# EAGLE design danger (EAGLE 6.6.0)
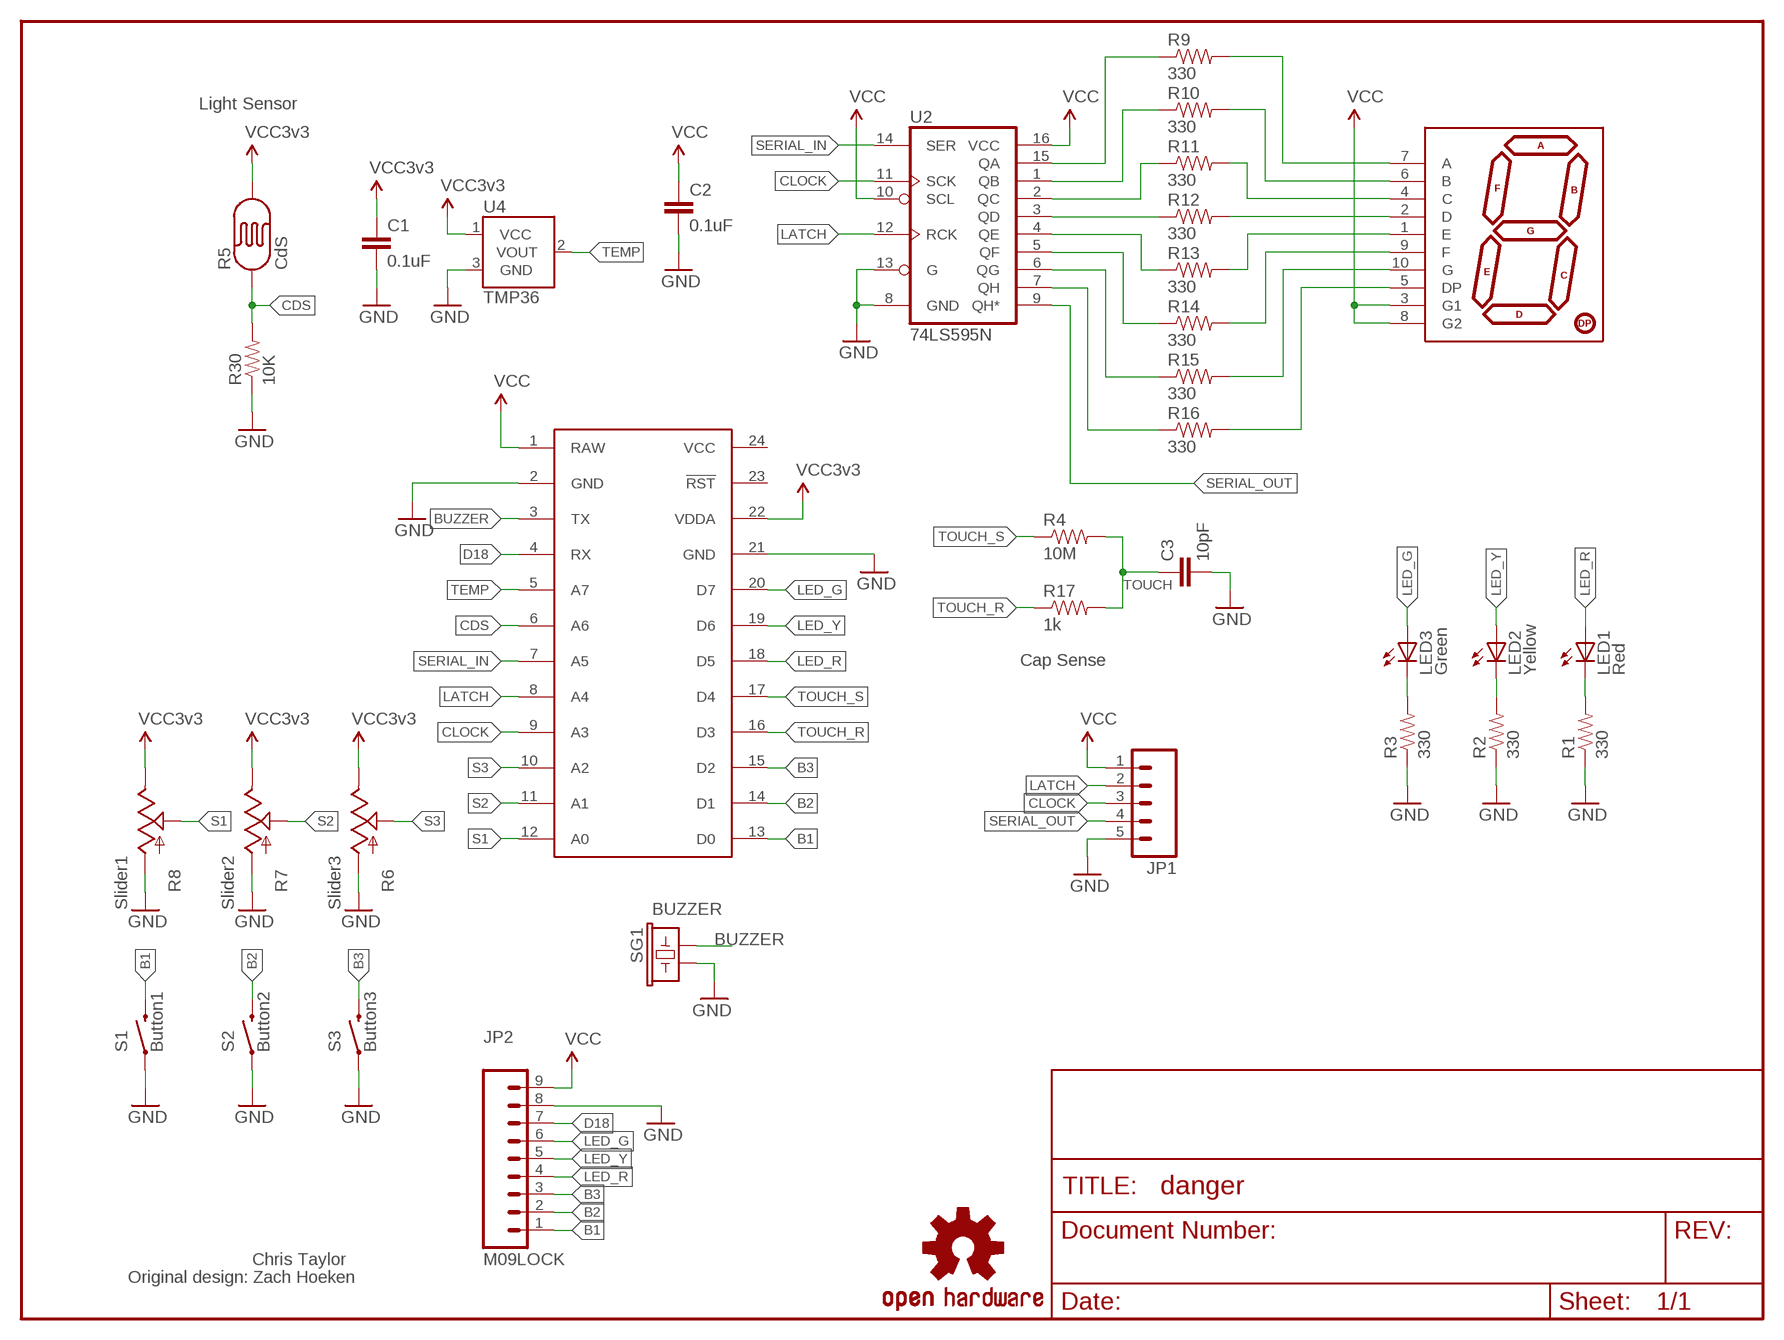
[diagram p0: schematic, sheet 1]

## Parts
C1  0.1uF  CAPPTH2  [CAP-PTH-SMALL2]
C2  0.1uF  CAPPTH2  [CAP-PTH-SMALL2]
C3  10pF  CAPPTH2  [CAP-PTH-SMALL2]
IC1  SPARK_CORECORE  [SPARK_CORE]
JP1  M05PTH  [1X05]
JP2  M09LOCK  [1X09_LOCK]
LED1  Red  LED5MM  [LED5MM]
LED2  Yellow  LED5MM  [LED5MM]
LED3  Green  LED5MM  [LED5MM]
R1  330  RESISTORAXIAL-0.3  [AXIAL-0.3]
R2  330  RESISTORAXIAL-0.3  [AXIAL-0.3]
R3  330  RESISTORAXIAL-0.3  [AXIAL-0.3]
R4  10M  RESISTORAXIAL-0.3  [AXIAL-0.3]
R5  CdS  PHOTOCELLPTH  [PHOTOCELL]
R6  Slider3  SLIDER  [SLIDER]
R7  Slider2  SLIDER  [SLIDER]
R8  Slider1  SLIDER  [SLIDER]
R9  330  RESISTORAXIAL-0.3  [AXIAL-0.3]
R10  330  RESISTORAXIAL-0.3  [AXIAL-0.3]
R11  330  RESISTORAXIAL-0.3  [AXIAL-0.3]
R12  330  RESISTORAXIAL-0.3  [AXIAL-0.3]
R13  330  RESISTORAXIAL-0.3  [AXIAL-0.3]
R14  330  RESISTORAXIAL-0.3  [AXIAL-0.3]
R15  330  RESISTORAXIAL-0.3  [AXIAL-0.3]
R16  330  RESISTORAXIAL-0.3  [AXIAL-0.3]
R17  1k  RESISTORAXIAL-0.3  [AXIAL-0.3]
R30  10K  RESISTORAXIAL-0.3  [AXIAL-0.3]
S1  Button1  SWITCH-MOMENTARY-212MM  [TACTILE-PTH-12MM]
S2  Button2  SWITCH-MOMENTARY-212MM  [TACTILE-PTH-12MM]
S3  Button3  SWITCH-MOMENTARY-212MM  [TACTILE-PTH-12MM]
SG1  BUZZER  BUZZERPTH  [BUZZER-12MM]
U2  74LS595N  [DIL16]
U4  TMP36  TMP36GT9  [TO-92]
U6  7-SEGMENT-DISPLAY-1"-RED  [7-SEGMENT-1"PTH]
U$2  OSHW-LOGOM  [OSHW-LOGO-M]

## Nets
B1: IC1.13(D0) JP2.1 S1.3
B2: IC1.14(D1) JP2.2 S2.3
B3: IC1.15(D2) JP2.3 S3.3
BUZZER: IC1.3(TX) SG1.+
CDS: IC1.6(A6) R5.1 R30.P$2
CLOCK: IC1.9(A3) JP1.3 U2.11(SCK)
D18: IC1.4(RX) JP2.7
GND: C1.2 C2.2 C3.2 IC1.2(GND) IC1.21(GND) JP1.5 JP2.8 R1.P$1 R2.P$1 R3.P$1 R6.3(A) R7.3(A) R8.3(A) R30.P$1 S1.1 S2.1 S3.1 SG1.- U2.8(GND) U2.13(G) U4.3(GND)
LATCH: IC1.8(A4) JP1.2 U2.12(RCK)
LED_G: IC1.20(D7) JP2.6 LED3.A
LED_R: IC1.18(D5) JP2.4 LED1.A
LED_Y: IC1.19(D6) JP2.5 LED2.A
N$2: R9.P$1 U2.15(QA)
N$3: LED1.K(C) R1.P$2
N$4: R10.P$1 U2.1(QB)
N$5: R11.P$1 U2.2(QC)
N$6: R12.P$1 U2.3(QD)
N$7: R13.P$1 U2.4(QE)
N$8: R14.P$1 U2.5(QF)
N$9: R15.P$1 U2.6(QG)
N$10: R16.P$1 U2.7(QH)
N$11: R9.P$2 U6.7(A)
N$12: R10.P$2 U6.6(B)
N$13: R11.P$2 U6.4(C)
N$14: R12.P$2 U6.2(D)
N$15: R13.P$2 U6.1(E)
N$16: R14.P$2 U6.9(F)
N$17: R15.P$2 U6.10(G)
N$18: R16.P$2 U6.5(DP)
N$19: LED2.K(C) R2.P$2
N$20: LED3.K(C) R3.P$2
S1: IC1.12(A0) R8.2A(S)
S2: IC1.11(A1) R7.2A(S)
S3: IC1.10(A2) R6.2A(S)
SERIAL_IN: IC1.7(A5) U2.14(SER)
SERIAL_OUT: JP1.4 U2.9(QH*)
TEMP: IC1.5(A7) U4.2(VOUT)
TOUCH: C3.1 R4.P$2 R17.P$2
TOUCH_R: IC1.16(D3) R17.P$1
TOUCH_S: IC1.17(D4) R4.P$1
VCC: C2.1 IC1.1(RAW) JP1.1 JP2.9 U2.10(SCL) U2.16(VCC) U6.3(G1) U6.8(G2)
VCC3V3: C1.1 IC1.22(VDDA) R5.2 R6.1(E) R7.1(E) R8.1(E) U4.1(VCC) ; supply symbol labelled VCC3v3
Unconnected: IC1.23(!RST)

## Notes on the sheet
- Light Sensor
- Cap Sense
- Chris Taylor
- Original design: Zach Hoeken

## Power pins joined to a net without a drawn wire
VCC: IC1.24(VCC)

## Library data of the parts
C1-C3 = SparkFun-Passives:CAP: Capacitor Standard 0603 ceramic capacitor, and 0.1" leaded capacitor.
IC1 = Spark:SPARK_CORE
JP1 = SparkFun:M05: Header 5 Standard 5-pin 0.1" header. Use with straight break away headers (SKU : PRT-00116), right angle break away headers (PRT-00553), swiss pins (PRT-00743), machine pins (PRT-00117), and female headers (PRT-00115). Molex polarized connector foot print use with SKU : PRT-08230 with associated crimp pins and housings.
JP2 = SparkFun-Connectors:M09: Header 9 Standard 9-pin 0.1" header. Use with straight break away headers (SKU : PRT-00116), right angle break away headers (PRT-00553), swiss pins (PRT-00743), machine pins (PRT-00117), and female headers (PRT-00115).
LED1-LED3 = SparkFun:LED: LEDs Standard schematic elements and footprints for 5mm, 3mm, 1206, and 0603 sized LEDs. 5mm - Spark Fun Electronics SKU : COM-00529 (and others)
R1-R4 R9-R17 R30 = SparkFun:RESISTOR: Resistor Basic schematic elements and footprints for 0603, 1206, and PTH resistors.
R5 = SparkFun:PHOTOCELL: Photocell Also known as a CdS photoresistor. This is a low cost way to detect light levels. Resistance decreases with more incoming light. SparkFun SKU: SEN-09088
R6-R8 = SparkFun:SLIDER
S1-S3 = SparkFun:SWITCH-MOMENTARY-2
SG1 = SparkFun:BUZZER: Buzzer 12mm Spark Fun Electronics SKU : Comp-Buzzer
U2 = SparkFun:74*595: 8-bit SHIFT REGISTER, output latch
U4 = SparkFun-Sensors:TMP36: Precision degC temp sensor, analog out
U6 = SparkFun:7-SEGMENT-DISPLAY-1"-RED: 7-Segment Display 1" Red (COM-08546)
U$2 = SparkFun-Aesthetics:OSHW-LOGO: Open Source Hardware Logo This logo indicates the piece of hardware it is found on incorporates a OSHW license and/or adheres to the definition of open source hardware found here: http://freedomdefined.org/OSHW

## Board
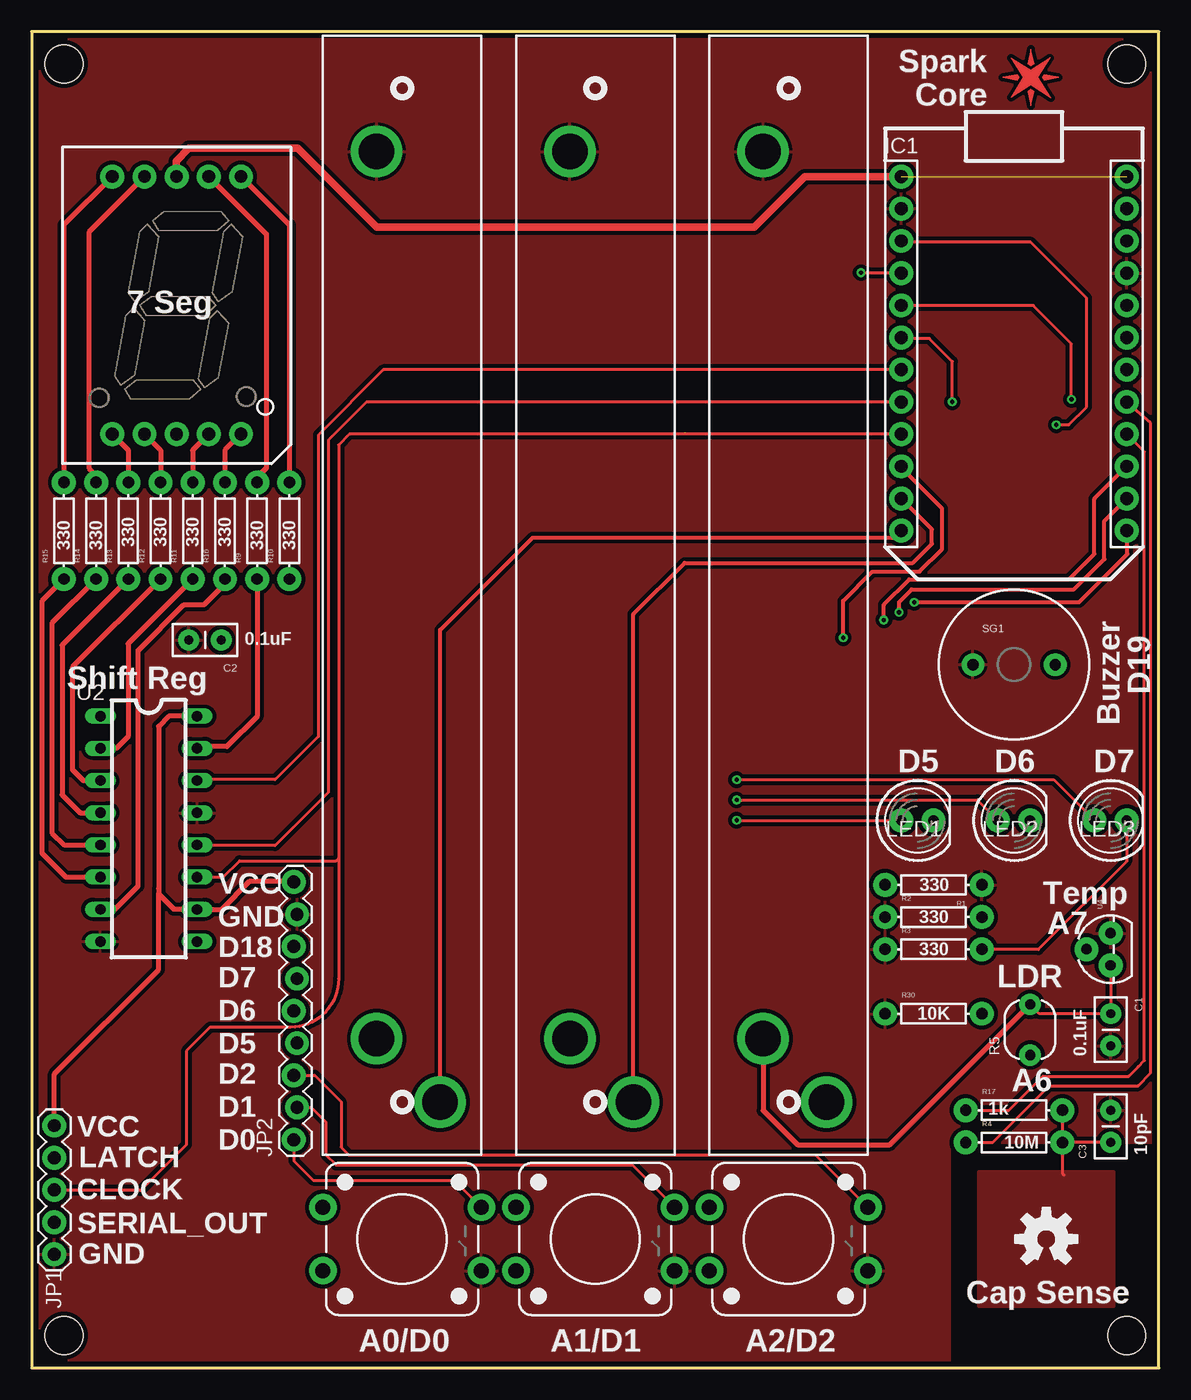
[diagram p1: board, top side]
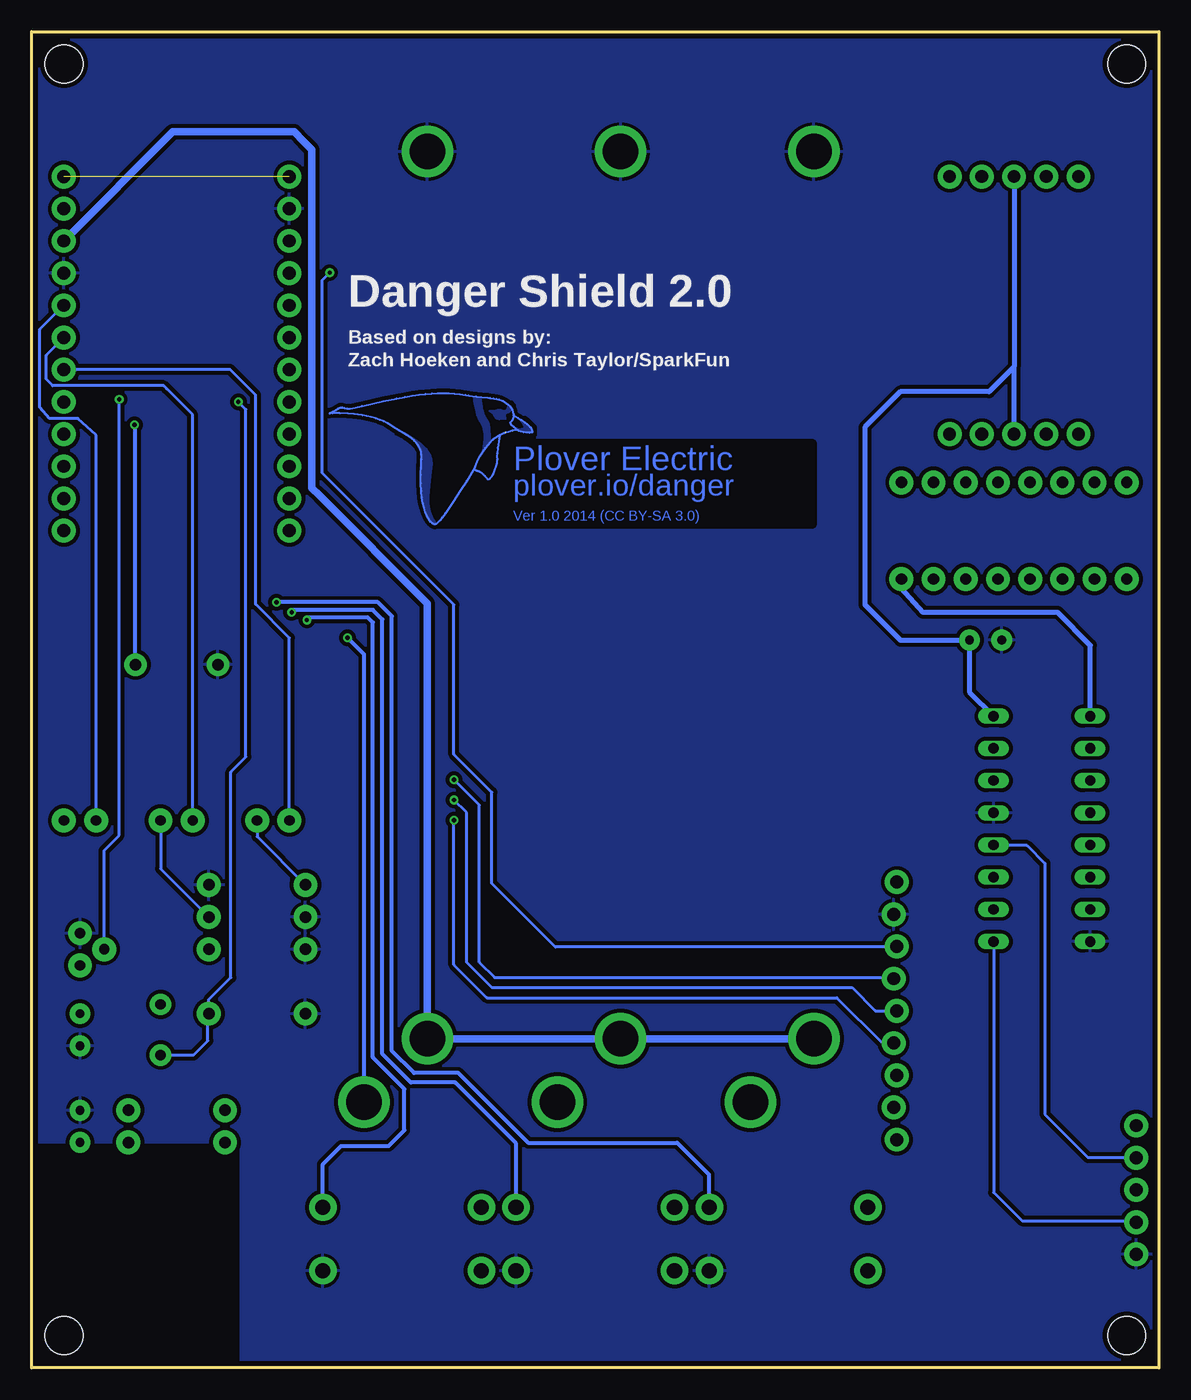
[diagram p2: board, bottom side, seen from below]

Size 88.9 x 105.41 mm. Coordinates in mm from the lower left corner, seen from the top.
Outline: 0,0 88.9,0 88.9,105.41 0,105.41 0,0
Copper layers (1*16): Top 0.0356mm / dielectric 1.5011mm / Bottom 0.0356mm
Design rules "LaenPCBOrder": minimum track width 6mil, minimum drill 13mil, track to track 6mil, track to pad 6mil, pad to pad 6mil, via to via 6mil, smd to smd 6mil, copper to edge 15mil, drill to drill 6mil, minimum pad ring 7mil, minimum via ring 7mil, stop-mask expansion 3mil, vias tented up to drill 0mil, thermal gap 10mil
Holes 3 mm at 2.54,102.87 86.36,102.87 2.54,2.54 86.36,2.54
bRestrict: area 27.3,66.6 to 56.6,72.9

### Footprints (pad centres in the part's own frame; a part is rotated, then mirrored left to right if it is on the bottom)
CAP-PTH-SMALL2 = drill 0.7 pad 1.651: 1 0,0; 2 2.54,0
SPARK_CORE = drill 1.016 pad 1.88: 1 -8.89,13.97; 2 -8.89,11.43; 3 -8.89,8.89; 4 -8.89,6.35; 5 -8.89,3.81; 6 -8.89,1.27; 7 -8.89,-1.27; 8 -8.89,-3.81; 9 -8.89,-6.35; 10 -8.89,-8.89; 11 -8.89,-11.43; 12 -8.89,-13.97; 13 8.89,-13.97; 14 8.89,-11.43; 15 8.89,-8.89; 16 8.89,-6.35; 17 8.89,-3.81; 18 8.89,-1.27; 19 8.89,1.27; 20 8.89,3.81; 21 8.89,6.35; 22 8.89,8.89; 23 8.89,11.43; 24 8.89,13.97
1X05 = drill 1.016 pad 1.88: 1 0,0; 2 2.54,0; 3 5.08,0; 4 7.62,0; 5 10.16,0
1X09_LOCK = drill 1.016 pad 1.88: 1 0,0.127; 2 2.54,-0.127; 3 5.08,0.127; 4 7.62,-0.127; 5 10.16,0.127; 6 12.7,-0.127; 7 15.24,0.127; 8 17.78,-0.127; 9 20.32,0.127
LED5MM = drill 0.813 pad 1.88: A -1.27,0; K 1.27,0
AXIAL-0.3 = drill 0.9 pad 1.88: P$1 -3.81,0; P$2 3.81,0
PHOTOCELL = drill 0.8 pad 1.676: 1 -2,0; 2 2,0
SLIDER = drill 2.8 pad 4.064: 1 -35,2; 2A -40,-3; 3 35,2
TACTILE-PTH-12MM = drill 1.2 pad 2.159: 1 6.25,-2.5; 2 -6.25,-2.5; 3 6.25,2.5; 4 -6.25,2.5
BUZZER-12MM = drill 0.9 pad 1.778: + 3.25,0; - -3.25,0
DIL16 = drill 0.813 long: 1 -8.89,-3.81; 2 -6.35,-3.81; 3 -3.81,-3.81; 4 -1.27,-3.81; 5 1.27,-3.81; 6 3.81,-3.81; 7 6.35,-3.81; 8 8.89,-3.81; 9 8.89,3.81; 10 6.35,3.81; 11 3.81,3.81; 12 1.27,3.81; 13 -1.27,3.81; 14 -3.81,3.81; 15 -6.35,3.81; 16 -8.89,3.81
TO-92 = drill 0.813 pad 1.88: 1 -1.27,0; 2 0,1.905; 3 1.27,0
7-SEGMENT-1"PTH = drill 1 pad 1.88: 1 -5.08,-10.16; 2 -2.54,-10.16; 3 0,-10.16; 4 2.54,-10.16; 5 5.08,-10.16; 6 5.08,10.16; 7 2.54,10.16; 8 0,10.16; 9 -2.54,10.16; 10 -5.08,10.16

### Placement (x,y rotation side)
C1  85.09,27.94 270 top
C2  14.94,57.42 180 top
C3  85.09,17.78 90 top
IC1  77.47,80.01 0 top
JP1  1.79,19.11 270 top
JP2  20.8,18 90 top
LED1  69.85,43.18 0 top
LED2  77.47,43.18 0 top
LED3  85.09,43.18 0 top
R1  71.12,38.1 180 top
R2  71.12,35.56 0 top
R3  71.12,33.02 0 top
R4  77.47,17.78 0 top
R5  78.74,26.67 90 top
R6  59.69,60.96 90 top
R7  44.45,60.96 90 top
R8  29.21,60.96 90 top
R9  17.78,66.04 90 top
R10  20.32,66.04 90 top
R11  12.7,66.04 90 top
R12  10.16,66.04 90 top
R13  7.62,66.04 90 top
R14  5.08,66.04 90 top
R15  2.54,66.04 90 top
R16  15.24,66.04 90 top
R17  77.47,20.32 0 top
R30  71.12,27.94 0 top
S1  29.21,10.16 0 top
S2  44.45,10.16 0 top
S3  59.69,10.16 0 top
SG1  77.47,55.48 0 top
U2  9.23,42.52 270 top
U4  85.09,33.02 90 top
U6  11.43,83.82 0 top
U$1  [SPARK_LOGO_PLUS_PLANE]  78.8,101.8 0 top
U$2  80.01,10.16 0 top

### Tracks (layer width: path | path; a pad name or v marks a point on that pad's centre or on a via)
B1  (via drill 0.33)
  Top 0.254: JP2.1 20.67,16.33 22.2,14.8 33.32,14.8 S1.3
  Top 0.305: v69.6,60.4 82.6,60.4 86.4,64.2 86.4,66 IC1.13
  Bottom 0.305: S1.3 35.5,12.7 35.5,15.25 38,17.75 49.75,17.75 55.25,23.25 58.75,23.25 60.5,25 60.5,59.3 61.6,60.4 v69.6,60.4
B2  (via drill 0.33)
  Top 0.254: JP2.2 22.06,20.54 23.2,19.4 23.2,16.8 24,16 47.36,16 S2.3
  Top 0.305: v68.4,59.6 68.4,60.4 69.4,61.4 82.2,61.4 84.6,63.8 84.6,66.82 IC1.14
  Bottom 0.305: S2.3 50.7,17.7 55.5,22.5 59,22.5 61.25,24.75 61.25,59.05 62,59.8 68.2,59.8 v68.4,59.6
B3  (via drill 0.33)
  Top 0.254: JP2.3 22.32,23.08 24.4,21 24.4,17.4 25,16.8 61.8,16.8 S3.3
  Top 0.305: v67.2,59 67.2,60.2 69.2,62.2 81.8,62.2 83.8,64.2 83.8,68.56 IC1.15
  Bottom 0.305: S3.3 65.94,16.06 64.5,17.5 60.75,17.5 59.5,18.75 59.5,22 62,24.5 62,58.8 62.4,59.2 67,59.2 v67.2,59
BIRD  (1 unrouted)
  Bottom 0.152: 50.9,75.13 50.9,75.11 50.92,74.98 50.96,74.84 51,74.75 51.06,74.66 51.14,74.59 51.19,74.56 51.1,74.47 50.85,74.2 50.73,74.09 50.62,74 50.55,73.96 50.5,73.94 50.48,73.94 | 51.52,73.78 51.53,73.77 51.67,73.73 51.84,73.66 51.99,73.58 52.15,73.48 52.33,73.36 52.52,73.21 52.72,73.03 52.93,72.81 53.14,72.56 53.34,72.27 53.55,71.94 53.74,71.56 53.93,71.14 54.01,70.9 | 65.42,75.3 65.37,75.32 65.14,75.44 64.92,75.57 64.8,75.65 64.73,75.69 64.62,75.74 64.51,75.76 64.4,75.76 64.23,75.73 64.04,75.69 63.88,75.67 63.8,75.66 62.85,75.88 61.19,76.25 60.12,76.47 59.48,76.59 58.89,76.69 58.34,76.77 57.83,76.83 57.34,76.87 56.88,76.89 56.44,76.9 56,76.88 55.57,76.85 55.13,76.81 54.67,76.75 54.44,76.71 53.84,76.64 52.92,76.53 52.77,76.52 52.47,76.48 52.23,76.43 52.06,76.39 51.9,76.33 51.75,76.27 51.6,76.19 51.46,76.1 51.33,75.99 51.21,75.87 51.1,75.73 51.02,75.58 50.95,75.4 50.9,75.21 50.88,75.1 50.82,75.07 50.53,74.93 50.27,74.78 50,74.59 49.8,74.44 49.68,74.33 49.58,74.21 49.5,74.1 49.45,73.98 49.42,73.89 49.42,73.82 49.42,73.79 49.45,73.79 49.66,73.78 49.91,73.79 50.1,73.82 50.32,73.87 50.53,73.94 50.64,73.99 50.69,73.98 50.98,73.92 51.31,73.84 51.54,73.77 51.76,73.69 51.89,73.62 51.97,73.58 52,73.55 52.04,73.34 52.16,72.57 52.2,72.16 52.21,71.94 52.21,71.85 52.2,71.78 52.2,71.64 52.22,71.49 52.24,71.33 52.3,71.08 52.41,70.77 52.5,70.55 52.56,70.42 52.63,70.31 52.7,70.22 52.76,70.14 52.82,70.1 52.88,70.08 52.92,70.09 52.94,70.11 52.95,70.12 53.02,70.21 53.15,70.35 53.27,70.47 53.38,70.56 53.48,70.63 53.58,70.69 53.69,70.74 53.82,70.78 53.91,70.81 53.95,70.84 53.96,70.87 53.97,70.92 53.97,70.98 53.97,71.02 54.09,70.82 54.6,69.97 55.09,69.19 55.63,68.36 56.04,67.76 56.29,67.4 56.53,67.09 56.73,66.83 56.87,66.69 56.94,66.62 57.01,66.57 57.06,66.55 57.08,66.55 57.1,66.54 57.15,66.55 57.23,66.58 57.31,66.64 57.41,66.73 57.52,66.85 57.63,67.02 57.74,67.24 57.85,67.5 57.95,67.83 58.05,68.21 58.12,68.66 58.18,69.18 58.21,69.78 58.22,70.45 58.19,71.21 58.17,71.62 58.16,71.69 58.15,71.82 58.15,71.94 58.16,72.06 58.19,72.24 58.25,72.45 58.34,72.65 58.46,72.83 58.59,72.99 58.74,73.15 58.91,73.29 59.09,73.43 59.39,73.62 59.79,73.86 60.2,74.1 60.4,74.23 60.54,74.33 60.84,74.51 61.16,74.67 61.48,74.81 61.8,74.92 62.14,75.02 62.48,75.1 62.81,75.16 63.15,75.21 63.48,75.25 63.97,75.28 64.59,75.3 65.16,75.3 65.42,75.3
  pour Bottom (no thermals): 54.05,76.62 54.05,76.57 54.02,76.3 53.99,76.04 53.94,75.73 53.86,75.41 53.78,75.16 53.72,75 53.65,74.85 53.57,74.72 53.52,74.65 53.47,74.58 53.39,74.42 53.33,74.24 53.28,74.05 53.25,73.86 53.23,73.67 53.22,73.47 53.22,73.28 53.24,73 53.27,72.68 53.33,72.36 53.34,72.29 52.79,72.97 52.67,73.07 52.75,73.39 52.75,73.63 52.76,73.9 52.79,74.19 52.83,74.4 52.87,74.53 52.92,74.65 52.98,74.76 53.01,74.81 53.05,74.87 53.13,75 53.2,75.13 53.26,75.28 53.33,75.5 53.39,75.78 53.42,76.05 53.44,76.28 53.44,76.51 53.44,76.56
  pour Bottom: 59.96,73.96 59.84,73.91 59.34,73.65 59,73.46 58.75,73.3 58.51,73.13 58.27,72.93 58.04,72.73 57.83,72.5 57.69,72.33 57.61,72.2 57.54,72.08 57.48,71.95 57.43,71.82 57.39,71.68 57.37,71.54 57.36,71.4 57.36,71.33 57.48,70.33 57.59,69.18 57.62,68.72 57.62,68.45 57.62,68.2 57.6,67.97 57.56,67.76 57.51,67.55 57.44,67.35 57.36,67.15 57.25,66.94 57.13,66.73 57.06,66.62 57.14,66.67 57.28,66.8 57.41,66.95 57.54,67.13 57.66,67.34 57.76,67.58 57.86,67.85 57.95,68.16 58.02,68.5 58.09,68.88 58.14,69.3 58.17,69.75 58.2,70.25 58.2,70.79 58.2,71.37 58.17,71.99 58.15,72.32 58.15,72.36 58.16,72.43 58.17,72.5 58.2,72.57 58.25,72.67 58.35,72.81 58.48,72.95 58.62,73.09 58.78,73.22 58.95,73.35 59.21,73.53 59.53,73.72 59.88,73.91
  pour Bottom: 50.65,74.12 50.61,74.11 50.43,74.07 50.29,74.07 50.18,74.07 50.12,74.09 50.07,74.12 50.04,74.16 50.03,74.22 50.04,74.29 50.07,74.38 50.14,74.49 50.19,74.55 50.23,74.61 50.29,74.7 50.3,74.74 50.3,74.75 50.28,74.76 50.23,74.74 50.16,74.7 50.02,74.59 49.8,74.4 49.64,74.25 49.55,74.14 49.48,74.04 49.43,73.96 49.41,73.9 49.41,73.87 49.41,73.85 49.43,73.83 49.44,73.82 49.47,73.81 49.54,73.79 49.68,73.78 49.89,73.79 50.11,73.82 50.32,73.87 50.5,73.94 50.6,73.99 50.64,74.03 50.67,74.06 50.66,74.1
  pour Bottom: 51.33,76 51.33,75.95 51.34,75.84 51.36,75.73 51.41,75.63 51.46,75.55 51.52,75.51 51.56,75.49 51.6,75.47 51.65,75.47 51.71,75.47 51.76,75.49 51.79,75.5 51.8,75.51 51.87,75.54 51.93,75.56 52.01,75.57 52.1,75.57 52.2,75.55 52.31,75.51 52.36,75.47 52.81,75.51 52.47,75.26 52.46,75.24 52.46,75.22 52.43,75.13 52.39,75.05 52.33,74.97 52.27,74.92 52.21,74.89 52.15,74.87 52.08,74.86 52,74.86 51.9,74.87 51.85,74.88 51.49,74.85 51.5,74.87 51.54,74.98 51.56,75.11 51.56,75.19 51.55,75.25 51.53,75.28 51.5,75.31 51.47,75.34 51.44,75.35 51.43,75.35 51.31,75.4 51.2,75.46 51.13,75.51 51.08,75.57 51.06,75.62 51.06,75.65 51.06,75.67
BUZZER  (via drill 0.33)
  Top 0.254: v80.8,74.4 81.8,74.4 83.2,75.8 83.2,84.4 78.8,88.8 68.68,88.8 IC1.3
  Bottom 0.305: SG1.+ 80.72,74.32 v80.8,74.4
CDS  (via drill 0.33)
  Top 0.254: v72.6,76.2 72.6,79.4 70.8,81.2 68.66,81.2 IC1.6
  Bottom 0.254: v72.6,76.2 72,75.6 72,48.2 73.2,47 73.2,30.8 74.93,29.07 R30.P$2 75,27.87 75,25.8 76.13,24.67 R5.1
CLOCK
  Top 0.254: IC1.9 25.06,73.66 24.2,72.8 24.2,40.2 | 24.2,40.2 24.2,30.7 arc-90 20.4,26.86 14.06,26.86 12.2,25 12.2,17.6 8.6,14 1.82,14 JP1.3 | U2.11 15.11,38.71 16.4,40 24,40 24.2,40.2
D18  (via drill 0.33)
  Top 0.254: v65.4,86.4 68.54,86.4 IC1.4
  Bottom 0.254: JP2.7 20.71,33.2 47.6,33.2 52.6,38.2 52.6,45.4 55.6,48.4 55.6,60.2 65,69.6 66,70.6 66,85.4 66,85.8 v65.4,86.4
GND
  pour Top (isolate 0.305, rank 3): 0,105.41 0,0 72.39,0 72.39,17.78 88.9,17.78 88.9,105.41
  pour Bottom (isolate 0.305, rank 2): 0,105.41 0,0 72.39,0 72.39,17.78 88.9,17.78 88.9,105.41
LATCH
  Top 0.254: IC1.8 26.4,76.2 23.4,73.2 23.4,45.4 19.2,41.2 13.09,41.2 U2.12
  Bottom 0.254: JP1.2 1.82,16.6 5.6,16.6 9,20 9,39.8 10.4,41.2 12.99,41.2 U2.12
LED_G  (via drill 0.33)
  Top 0.254: v55.6,46.4 80.6,46.4 LED3.A
  Bottom 0.254: LED3.A 83.82,73.57 85.25,74.9 87.5,74.9 88.25,75.75 88.25,81.93 IC1.20 | v55.6,46.4 53.6,44.4 53.6,32 52.4,30.8 21.03,30.8 JP2.6
LED_R  (via drill 0.33)
  Top 0.254: v55.6,43.2 68.56,43.2 LED1.A
  Bottom 0.254: LED1.A 68.58,57.58 71.25,60.25 71.25,76.75 73.25,78.75 IC1.18 | v55.6,43.2 55.6,31.8 53,29.2 25.4,29.2 21.82,25.62 JP2.4
LED_Y  (via drill 0.33)
  Top 0.254: v55.6,44.8 74.58,44.8 LED2.A
  Bottom 0.254: LED2.A 76.2,75.2 78.25,77.25 78.5,77.47 87.25,77.47 87.75,78 87.75,79.89 IC1.19 | v55.6,44.8 54.6,43.8 54.6,32 52.6,30 24.2,30 22.36,28.16 JP2.5
N$2
  Top 0.406: R9.P$1 17.78,51.38 15.4,49 13.17,49 U2.15
N$3
  Bottom 0.254: LED1.K 71.12,41.91 R1.P$2
N$4
  Bottom 0.406: U2.1 5.4,51.43 5.4,57 8,59.6 18.6,59.6 20.32,61.52 R10.P$1
N$5
  Top 0.406: R11.P$1 7.6,57.13 7.6,49.8 6.67,48.87 U2.2
N$6
  Top 0.406: R12.P$1 3.2,55.27 3.2,47.2 4.07,46.33 U2.3
N$7
  Top 0.406: R13.P$1 2.4,57.01 2.4,45.2 3.81,43.79 U2.4
N$8
  Top 0.406: R14.P$1 1.6,58.75 1.6,42.2 2.55,41.25 U2.5
N$9
  Top 0.406: R15.P$1 0.8,60.49 0.8,40.6 2.69,38.71 U2.6
N$10
  Top 0.406: U2.7 5.45,36.2 6.6,36.2 8.4,38 8.4,56.6 12,60.2 13.6,60.2 15.24,61.84 R16.P$1
N$11
  Top 0.406: U6.7 18.5,89.45 18.5,71 17.78,70.28 R9.P$2
N$12
  Top 0.406: U6.6 20.32,90.17 R10.P$2
N$13
  Top 0.406: U6.4 12.7,72.39 R11.P$2
N$14
  Top 0.406: U6.2 10.16,72.39 R12.P$2
N$15
  Top 0.406: U6.1 7.62,72.39 R13.P$2
N$16
  Top 0.406: U6.9 4.5,89.59 4.5,71 5.08,70.42 R14.P$2
N$17
  Top 0.406: U6.10 2.54,90.17 R15.P$2
N$18
  Top 0.406: U6.5 15.24,72.39 R16.P$2
N$19
  Bottom 0.254: LED2.K 78.74,39.37 R2.P$2
N$20
  Top 0.254: LED3.K 86.36,39.96 79.4,33 74.95,33 R3.P$2
S1
  Top 0.305: R8.2A 32.21,58.21 39.5,65.5 68.04,65.5 IC1.12
S2
  Top 0.305: R7.2A 47.45,59.45 51.5,63.5 69.5,63.5 71,65 71,66.16 IC1.11
S3  (via drill 0.33)
  Top 0.305: IC1.10 68.58,71.02 71.8,67.8 71.8,64.6 70,62.8 66.3,62.8 64,60.5 v64,57.6
  Bottom 0.305: R6.2A 62.69,56.29 v64,57.6
SERIAL_IN
  Top 0.254: IC1.7 27.74,78.74 22.6,73.6 22.6,49.8 19.2,46.4 13.11,46.4 U2.14
SERIAL_OUT
  Bottom 0.254: U2.9 13.04,13.84 10.8,11.6 1.9,11.6 JP1.4
TEMP  (via drill 0.33)
  Top 0.254: v82,76.4 82,80.8 79,83.8 68.6,83.8 IC1.5
  Bottom 0.254: U4.2 83.19,40.81 82,42 v82,76.4
TOUCH
  Top 0.254: R17.P$2 R4.P$2 | R4.P$2 81.28,15.32 81.4,15.2 | C3.1 R4.P$2
  pour Top: 74.68,15.49 85.34,15.49 85.34,4.83 74.68,4.83
TOUCH_R
  Top 0.254: R17.P$1 77.07,20.32 79.75,23 86.5,23 87.25,23.75 87.75,24.25 87.75,72.27 IC1.16
TOUCH_S
  Top 0.254: R4.P$1 75.78,17.78 80.25,22.25 87.25,22.25 88.25,23.25 88.25,74.56 IC1.17
VCC  (1 unrouted)
  Top 0.406: U2.16 10.81,51.41 10,50.6 10,37.8 10,37.4 | 10,37.4 11.2,36.2 13.01,36.2 U2.10 14.97,36.17 17.2,38.4 20.59,38.4 JP2.9 | JP1.1 1.79,23.19 10,31.4 10,37.4
  Top 0.61: IC1.1 60.98,93.98 57,90 27.2,90 21,96.2 12.4,96.2 11.4,95.2 11.4,94.01 U6.8
  Bottom 0.406: U6.8 11.43,78.97 | 11.43,78.97 13.4,77 20.4,77 23.2,74.2 23.2,60.2 20.4,57.4 14.96,57.4 | U6.3 11.43,78.97 | 14.96,57.4 C2.1 | 14.96,57.4 14.96,53.33 U2.16
VCC3V3
  Top 0.254: R5.2 79.47,27.94 C1.1 U4.1
  Top 0.406: R6.1 57.69,20.31 60.4,17.6 67.67,17.6 R5.2
  Bottom 0.61: IC1.22 77.76,97.5 68.2,97.5 67.45,96.75 66.8,96.1 66.8,69.4 66.2,68.8 57.69,60.29 R6.1 R7.1 R8.1

### Text on the board
Bottom: Plover Electric | plover.io/danger | Ver 1.0 2014 (CC BY-SA 3.0)
tPlace: Spark / Core | 7 Seg | 0.1uF | Shift Reg | D19 | Buzzer | D5 | D6 | D7 | Temp | VCC | A7 | GND | D18 | LDR | D7 | D6 | D5 | 0.1uF | A6 | D2 | D1 | VCC | D0 | 10pF | LATCH | CLOCK | SERIAL_OUT | GND | Cap Sense | A0/D0 | A1/D1 | A2/D2
bPlace: Danger Shield 2.0 | Based on designs by: | Zach Hoeken and Chris Taylor/SparkFun
bStop: Plover Electric | plover.io/danger | Ver 1.0 2014 (CC BY-SA 3.0)
Measures: 0 | 0 | 0 | 0